# Altium schematic sheet Block_UART, I2C, CAN and GPIOs.SchDoc
size A3; SheetNumber: 2; SheetTotal: 16
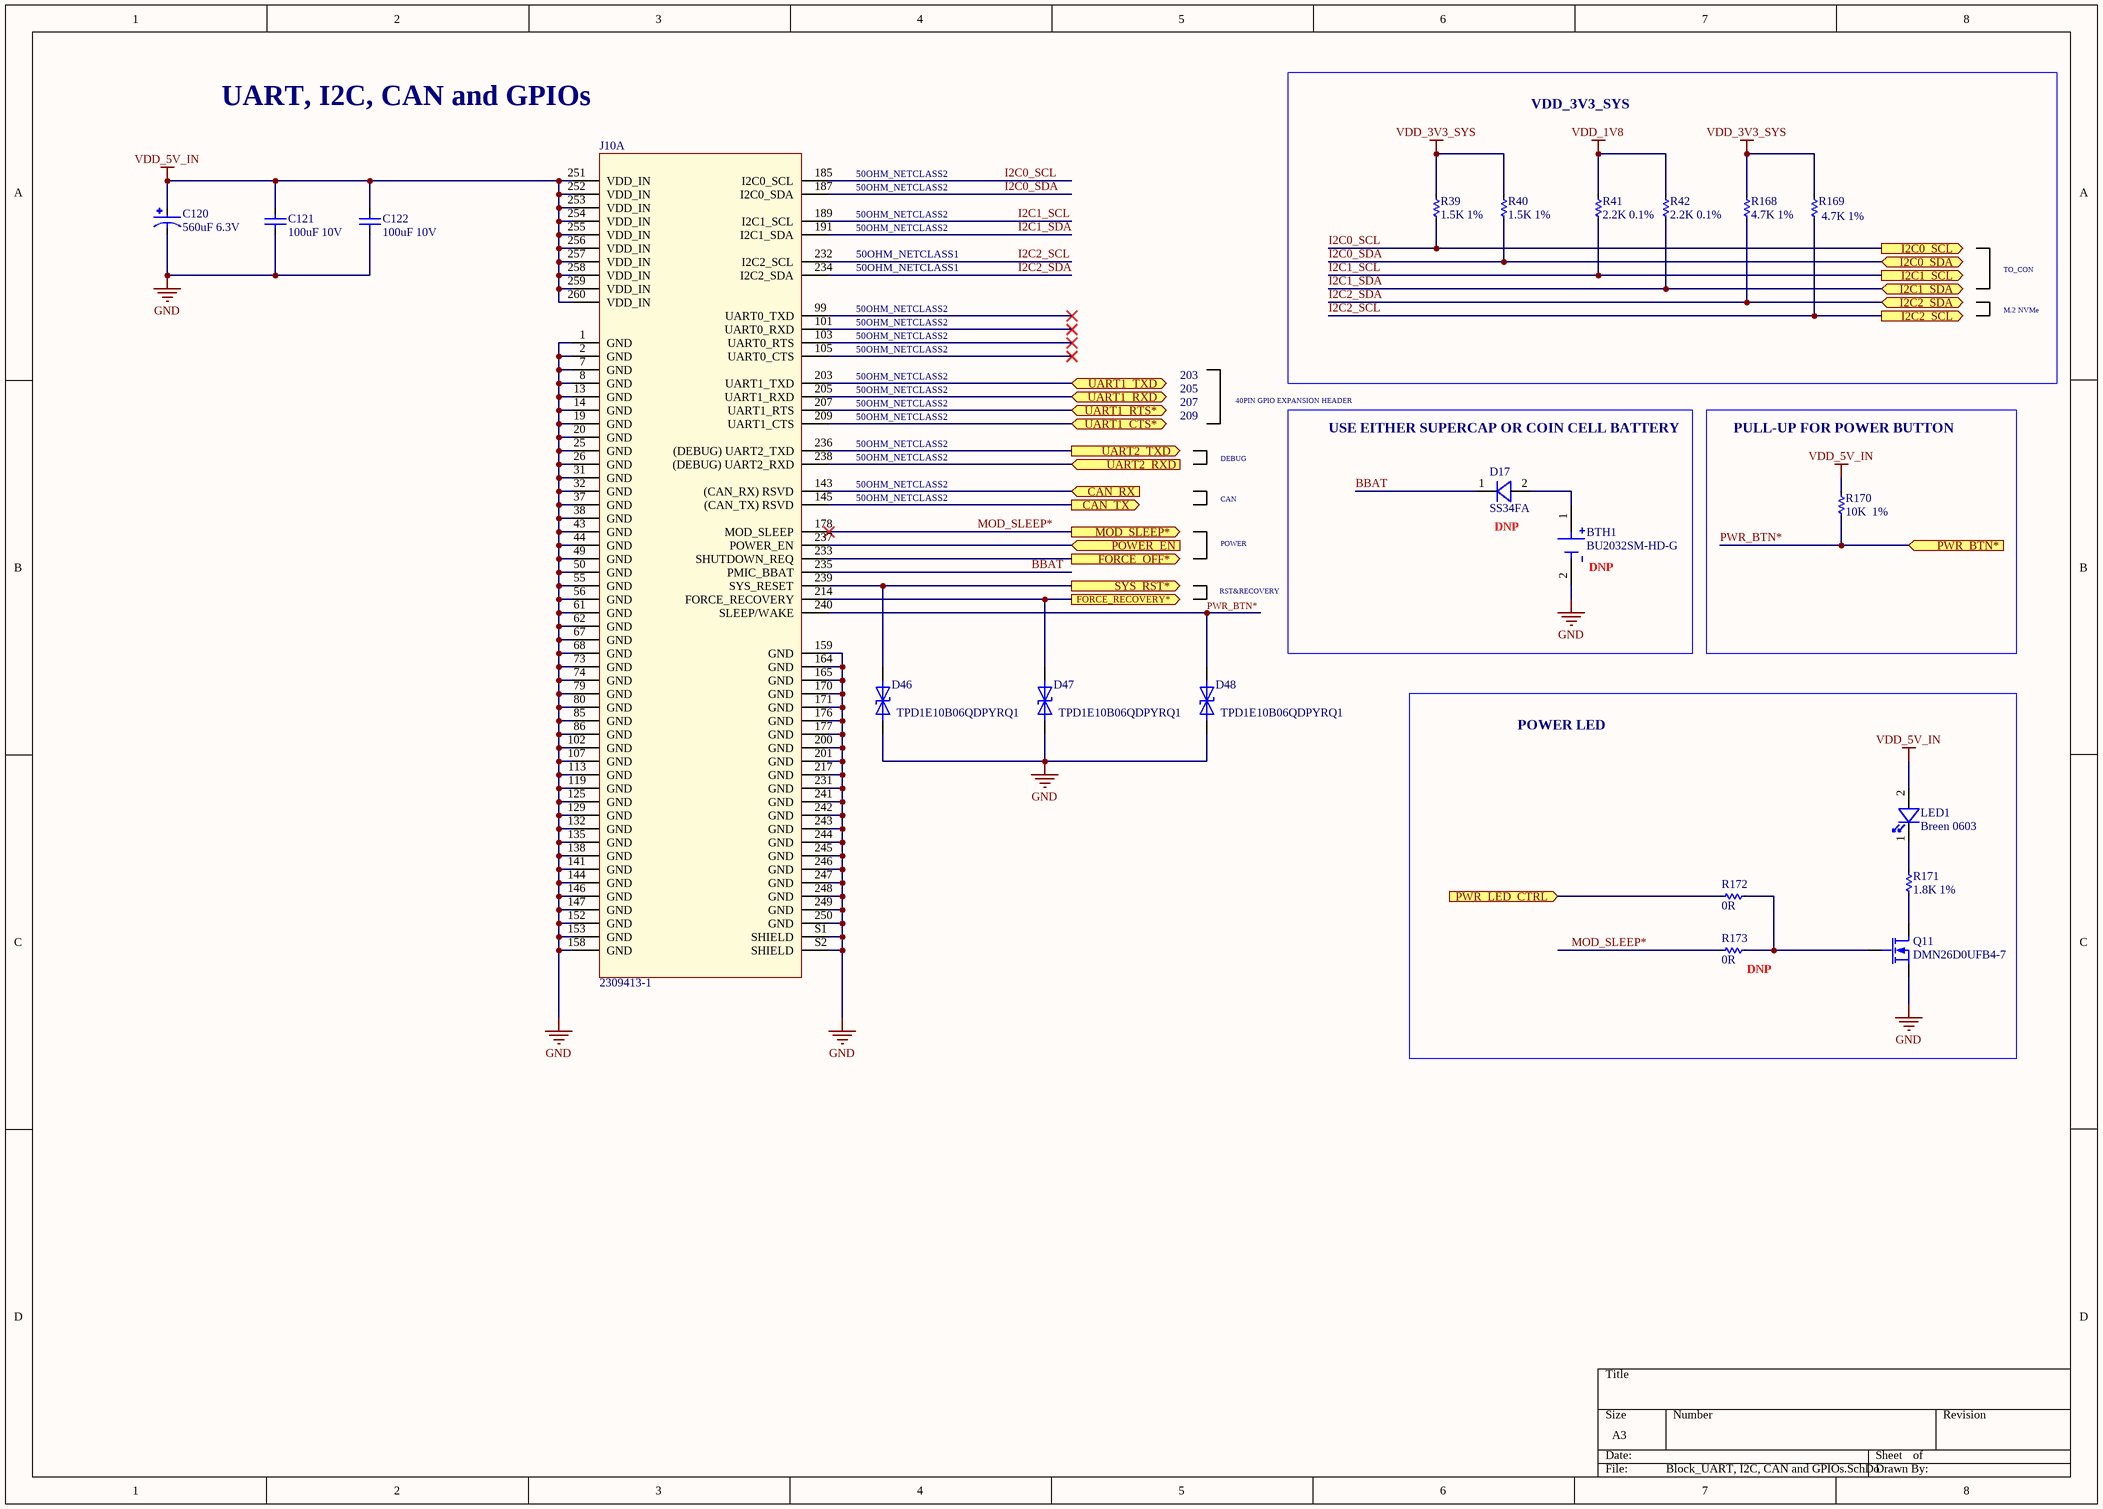
[diagram p0: Block_UART, I2C, CAN and GPIOs.SchDoc]

## Parts
BTH1  BU2032SM-HD-G  [BU2032SM-HD-G]
C120  560uF 6.3V  [CP_ELEC_8X7.7]
C121  100uF 10V  [C1210]
C122  100uF 10V  [C1210]
D17  SS34FA  [SOD123F]
D46  TPD1E10B06QDPYRQ1  [2-X1SON (1x.60)]
D47  TPD1E10B06QDPYRQ1  [2-X1SON (1x.60)]
D48  TPD1E10B06QDPYRQ1  [2-X1SON (1x.60)]
J10  2309413-1  [2309413-1]  (part A of 3)
LED1  Breen 0603  [LED_0603]
Q11  DMN26D0UFB4-7  [DFN1006-3]
R39  1.5K 1%  [R0402]
R40  1.5K 1%  [R0402]
R41  2.2K 0.1%  [R0603]
R42  2.2K 0.1%  [R0603]
R168  4.7K 1%  [R0402]
R169  4.7K 1%  [R0402]
R170  10K  1%  [R0402]
R171  1.8K 1%  [R0402]
R172  0R  [R0603]
R173  0R  [R0603]

## Blocks framed on the sheet
VDD_3V3_SYS: R39-R42 R168 R169
USE EITHER SUPERCAP OR COIN CELL BATTERY: BTH1 D17
PULL-UP FOR POWER BUTTON: R170
POWER LED: LED1 Q11 R171-R173

## Ports
CAN_RX (in), CAN_TX (out), FORCE_OFF* (out), FORCE_RECOVERY* (out), I2C0_SCL (out), I2C0_SDA (bidir), I2C1_SCL (out), I2C1_SDA (bidir), I2C2_SCL (out), I2C2_SDA (bidir), MOD_SLEEP* (out), POWER_EN (in), PWR_BTN* (in), PWR_LED_CTRL (in), SYS_RST* (out), UART1_CTS* (bidir), UART1_RTS* (bidir), UART1_RXD (bidir), UART1_TXD (bidir), UART2_RXD (in), UART2_TXD (out)

## Nets
GND: BTH1.2(NEG) C120.2(C) C121.1 C122.1 D46.1 D47.1 D48.1 J10.1(GND) J10.2(GND) J10.7(GND) J10.8(GND) J10.13(GND) J10.14(GND) J10.19(GND) J10.20(GND) J10.25(GND) J10.26(GND) J10.31(GND) J10.32(GND) J10.37(GND) J10.38(GND) J10.43(GND) J10.44(GND) J10.49(GND) J10.50(GND) J10.55(GND) J10.56(GND) J10.61(GND) J10.62(GND) J10.67(GND) J10.68(GND) J10.73(GND) J10.74(GND) J10.79(GND) J10.80(GND) J10.85(GND) J10.86(GND) J10.102(GND) J10.107(GND) J10.113(GND) J10.119(GND) J10.125(GND) J10.129(GND) J10.132(GND) J10.135(GND) J10.138(GND) J10.141(GND) J10.144(GND) J10.146(GND) J10.147(GND) J10.152(GND) J10.153(GND) J10.158(GND) J10.159(GND) J10.164(GND) J10.165(GND) J10.170(GND) J10.171(GND) J10.176(GND) J10.177(GND) J10.200(GND) J10.201(GND) J10.217(GND) J10.231(GND) J10.241(GND) J10.242(GND) J10.243(GND) J10.244(GND) J10.245(GND) J10.246(GND) J10.247(GND) J10.248(GND) J10.249(GND) J10.250(GND) J10.S1(SHIELD) J10.S2(SHIELD) Q11.2(S)
VDD_1V8: R41.2 R42.2
VDD_3V3_SYS: R39.2 R40.2 R168.2 R169.2
VDD_5V_IN: C120.1(A) C121.2 C122.2 J10.251(VDD_IN) J10.252(VDD_IN) J10.253(VDD_IN) J10.254(VDD_IN) J10.255(VDD_IN) J10.256(VDD_IN) J10.257(VDD_IN) J10.258(VDD_IN) J10.259(VDD_IN) J10.260(VDD_IN) LED1.2(A) R170.2
BBAT: D17.1(K) J10.235(PMIC_BBAT)
CAN_RX: J10.143((CAN_RX)_RSVD) ; port CAN_RX
CAN_TX: J10.145((CAN_TX)_RSVD) ; port CAN_TX
FORCE_OFF*: J10.233(SHUTDOWN_REQ) ; port FORCE_OFF*
FORCE_RECOVERY*: D47.2 J10.214(FORCE_RECOVERY) ; port FORCE_RECOVERY*
I2C0_SCL: J10.185(I2C0_SCL) R39.1 ; port I2C0_SCL
I2C0_SDA: J10.187(I2C0_SDA) R40.1 ; port I2C0_SDA
I2C1_SCL: J10.189(I2C1_SCL) R41.1 ; port I2C1_SCL
I2C1_SDA: J10.191(I2C1_SDA) R42.1 ; port I2C1_SDA
I2C2_SCL: J10.232(I2C2_SCL) R169.1 ; port I2C2_SCL
I2C2_SDA: J10.234(I2C2_SDA) R168.1 ; port I2C2_SDA
MOD_SLEEP*: J10.178(MOD_SLEEP) R173.1 ; port MOD_SLEEP*
POWER_EN: J10.237(POWER_EN) ; port POWER_EN
PWR_BTN*: D48.2 J10.240(SLEEP/WAKE) R170.1 ; port PWR_BTN*
PWR_LED_CTRL: R172.1 ; port PWR_LED_CTRL
SYS_RST*: D46.2 J10.239(SYS_RESET) ; port SYS_RST*
UART1_CTS*: J10.209(UART1_CTS) ; port UART1_CTS*
UART1_RTS*: J10.207(UART1_RTS) ; port UART1_RTS*
UART1_RXD: J10.205(UART1_RXD) ; port UART1_RXD
UART1_TXD: J10.203(UART1_TXD) ; port UART1_TXD
UART2_RXD: J10.238((DEBUG)_UART2_RXD) ; port UART2_RXD
UART2_TXD: J10.236((DEBUG)_UART2_TXD) ; port UART2_TXD
NetBTH1_1: BTH1.1(POS) D17.2(A)
NetLED1_1: LED1.1(K) R171.2
NetQ11_1: Q11.1(G) R172.2 R173.2
NetQ11_3: Q11.3(D) R171.1

Not connected (* = marked no-connect by the designer): J10 99(UART0_TXD)* 101(UART0_RXD)* 103(UART0_RTS)* 105(UART0_CTS)*

## Notes on the sheet
- UART, I2C, CAN and GPIOs
- 50OHM_NETCLASS2
- 50OHM_NETCLASS1
- M.2 NVMe
- TO_CON
- 203
- 205
- 207
- 209
- 40PIN GPIO EXPANSION HEADER
- DEBUG
- CAN
- POWER
- (near D17) DNP
- (near BTH1) DNP
- RST&RECOVERY
- (near R173) DNP

## Library data of the parts
BTH1 = BU2032SM-HD-G: CR2032 socket on T & R (40; Manufacturer: Memory Protection Devices; Number of Cells: 1; Supplier 1: Digi-Key; Manufacturer Part Number: BU2032SM-HD-G; RoHS: Yes; Category: Connectors; Stock 1: 98391; Pricing 1: 1=1.29000, 10=1.09000, 50=0.95860, 100=0.90350 (USD); Mount: Surface Mount,PCB; Case/Package: SMD/SMT; Min Operating Temperature: -40°C; Max Operating Temperature: 280°C; Package Quantity: 1; Termination: SMD/SMT; Packaging: Cut Tape; Diameter: 20mm; Lead Free: Lead Free; ComponentLink1URL: https://datasheet.ciiva.com/3/bu2032sm-hd-g-datasheet-3825.pdf?src-supplier=Digi-Key; ComponentLink1Description: https://datasheet.ciiva.com/3/bu2032sm-hd-g-datasheet-3825.pdf?src-supplier=Digi-Key; ComponentLink2URL: https://datasheet.ciiva.com/3/bu2032sm-hd-g-datasheet-3826.pdf?src-supplier=Digi-Key; ComponentLink2Description: https://datasheet.ciiva.com/3/bu2032sm-hd-g-datasheet-3826.pdf?src-supplier=Digi-Key; ComponentLink3URL: https://datasheet.ciiva.com/3/bu2032sm-hd-g-datasheet-3827.pdf?src-supplier=Digi-Key; ComponentLink3Description: https://datasheet.ciiva.com/3/bu2032sm-hd-g-datasheet-3827.pdf?src-supplier=Digi-Key; Supplier Part Number 1: BU2032SM-HD-GCT-ND
C120 = RHA0J561MCN1GS: Cap Aluminum Polymer 560uF 6.3VDC 20% (8 X 7.7mm) SMD 0.009 Ohm 4500mA 2000h 105C T/R; Manufacturer: Nichicon; ESR (Equivalent Series Resistance): 9mR; Life (Hours): 2000Hour; Ripple Current: 4.5A; Leakage Current: 1.0584mA; Dissipation Factor: 0.12%; Supplier 1: Digi-Key; Manufacturer Part Number: RHA0J561MCN1GS; RoHS: Yes; Category: Polymer Capacitors; Stock 1: 37081; Pricing 1: 1=1.16000, 10=0.88500, 50=0.73500, 100=0.63290 (USD); Mount: Surface Mount; Case/Package: Radial; Min Operating Temperature: -55°C; Max Operating Temperature: 105°C; Capacitance: 560uF; Tolerance: 20%; Voltage Rating: 6.3V; Packaging: Tape and Reel; Package Quantity: 1; Voltage Rating (DC): 6.3V; Termination: SMD/SMT; Series: FPCAP, HA; Construction: Cylindrical; Diameter: 8mm; Length: 7.7mm; Width: 8.3mm; Height: 8.3mm; Height - Seated (Max): 0.303inch; Radiation Hardening: No; RoHS Compliant: Yes; ComponentLink1URL: https://datasheet.ciiva.com/16481/2009fpcap-catalog-hsha-16481370.pdf?src-supplier=Future+Electronics; ComponentLink1Description: https://datasheet.ciiva.com/16481/2009fpcap-catalog-hsha-16481370.pdf?src-supplier=Future+Electronics; ComponentLink2URL: https://datasheet.ciiva.com/101/e-hs-ha-101946.pdf?src-supplier=Digi-Key; ComponentLink2Description: https://datasheet.ciiva.com/101/e-hs-ha-101946.pdf?src-supplier=Digi-Key; ComponentLink3URL: https://datasheet.ciiva.com/101/e-hs-ha-101947.pdf?src-supplier=Digi-Key; ComponentLink3Description: https://datasheet.ciiva.com/101/e-hs-ha-101947.pdf?src-supplier=Digi-Key; ComponentLink4URL: https://datasheet.ciiva.com/101/e-hs-ha-101948.pdf?src-supplier=Digi-Key; ComponentLink4Description: https://datasheet.ciiva.com/101/e-hs-ha-101948.pdf?src-supplier=Digi-Key; Supplier Part Number 1: 493-3772-1-ND
C121 C122 = LMK325ABJ107MM-P: Multilayer Ceramic Capacitors (High dielectric type), 10V, 100 uF, ± 20 %, 1210, X5R, RoHS; Manufacturer: Taiyo Yuden; Tolerance: 20%; Supplier 1: Digi-Key; Manufacturer Part Number: LMK325ABJ107MM-P; RoHS: Yes; Category: Ceramic Capacitors; Stock 1: 461999; Pricing 1: 1=1.12000, 10=0.88100, 50=0.76360, 100=0.66080, 500=0.49930 (USD); Mount: Surface Mount; Case/Package: 1210; Case Code (Metric): 3225; Case Code (Imperial): 1210; Contact Plating: Tin; Min Operating Temperature: -55°C; Max Operating Temperature: 85°C; Capacitance: 100uF; Packaging: Tape and Reel; Voltage Rating: 10V; Dielectric: X5R; Termination: Wraparound; Length: 0.126inch; Width: 0.098inch; Thickness: 0.11inch; Lead Free: Lead Free; RoHS Compliant: Yes; ComponentLink1URL: http://ds.yuden.co.jp/TYCOMPAS/or/detail.do?productNo=LMK325ABJ107MM-P&dataUnit=M&src-supplier=Avnet; ComponentLink1Description: http://ds.yuden.co.jp/TYCOMPAS/or/detail.do?productNo=LMK325ABJ107MM-P&dataUnit=M&src-supplier=Avnet; ComponentLink2URL: http://ds.yuden.co.jp/TYCOMPAS/ut/detail.do?productNo=LMK325ABJ107MM-P&fileName=LMK325ABJ107MM-P_SS&mode=specSheetDownload&src-supplier=Digi-Key; ComponentLink2Description: http://ds.yuden.co.jp/TYCOMPAS/ut/detail.do?productNo=LMK325ABJ107MM-P&fileName=LMK325ABJ107MM-P_SS&mode=specSheetDownload&src-supplier=Digi-Key; ComponentLink3URL: https://www.yuden.co.jp/productdata/catalog/mlcc01_e.pdf?src-supplier=Digi-Key; ComponentLink3Description: https://www.yuden.co.jp/productdata/catalog/mlcc01_e.pdf?src-supplier=Digi-Key; Supplier Part Number 1: 587-4317-1-ND
D17 = SS34FA: SS34FA Series 40 V 3 A Surface Mount Schottky Barrier Rectifier - SOD-123FA; Manufacturer: ON Semiconductor / Fairchild; Average Rectified Current: 3A; Element Configuration: Single; Max Forward Surge Current (Ifsm): 80A; Max Repetitive Reverse Voltage (Vrrm): 40V; Supplier 1: Mouser; Manufacturer Part Number: SS34FA; RoHS: Yes; Category: Schottky Diodes; Stock 1: 147819; Pricing 1: 1=0.53000, 10=0.42000, 50=0.42000, 100=0.31500, 1000=0.20500, 10000=0.16500 (USD); Mount: Surface Mount; Case/Package: SOD; Weight: 0.019g; Packaging: Tape and Reel; Max Reverse Voltage (DC): 40V; RoHS Compliant: Yes; ComponentLink1URL: http://www.mouser.com/ds/2/149/SS34FA-1012641.pdf?src-supplier=Mouser; ComponentLink1Description: http://www.mouser.com/ds/2/149/SS34FA-1012641.pdf?src-supplier=Mouser; ComponentLink2URL: http://www.farnell.com/datasheets/2552647.pdf?src-supplier=Farnell; ComponentLink2Description: http://www.farnell.com/datasheets/2552647.pdf?src-supplier=Farnell; ComponentLink3URL: http://www.farnell.com/datasheets/2552647.pdf?src-supplier=Newark; ComponentLink3Description: http://www.farnell.com/datasheets/2552647.pdf?src-supplier=Newark; ComponentLink4URL: https://www.fairchildsemi.com/datasheets/SS/SS34FA.pdf?src-supplier=Digi-Key; ComponentLink4Description: https://www.fairchildsemi.com/datasheets/SS/SS34FA.pdf?src-supplier=Digi-Key; Supplier Part Number 1: 512-SS34FA
D46-D48 = TPD1E10B06QDPYRQ1: Automotive 12-pF, ±5.5V ±30-kV ESD protection diode in 0402 Package 2-X1SON -40 to 125; Manufacturer: Texas Instruments; Capacitance: 12pF; Number of Channels: 1; Supplier 1: Mouser; Manufacturer Part Number: TPD1E10B06QDPYRQ1; RoHS: Yes; Category: TVS Diodes; Stock 1: 130973; Pricing 1: 1=0.46000, 10=0.34900, 50=0.34900, 100=0.21800, 1000=0.11500, 10000=0.08800 (USD); Case/Package: 0402; Number of Pins: 2; Min Operating Temperature: -40°C; Max Operating Temperature: 125°C; Lead Free: Lead Free; RoHS Compliant: Yes; ComponentLink1URL: http://www.ti.com/lit/ds/symlink/tpd1e10b06-q1.pdf?src-supplier=Digi-Key; ComponentLink1Description: http://www.ti.com/lit/ds/symlink/tpd1e10b06-q1.pdf?src-supplier=Digi-Key; ComponentLink2URL: http://www.ti.com/general/docs/suppproductinfo.tsp?distId=10&amp;gotoUrl=http%3A%2F%2Fwww.ti.com%2Flit%2Fgpn%2Ftpd1e10b06-q1&src-supplier=Digi-Key; ComponentLink2Description: http://www.ti.com/general/docs/suppproductinfo.tsp?distId=10&amp;gotoUrl=http%3A%2F%2Fwww.ti.com%2Flit%2Fgpn%2Ftpd1e10b06-q1&src-supplier=Digi-Key; Supplier Part Number 1: 595-PD1E10B06QDPYRQ1
J10 = 2309413-1: Conn DDR4 DIMM Socket SKT 260 POS 0.5mm Solder RA SMD T/R; Manufacturer: TE Connectivity; Supplier 1: Mouser; Manufacturer Part Number: 2309413-1; RoHS: Yes; Category: Memory Connectors; Stock 1: 11271; Pricing 1: 1=1.81000, 10=1.54000, 50=1.54000, 100=1.47000, 1000=1.16000, 10000=1.15000 (USD); ComponentLink1URL: https://www.te.com/commerce/DocumentDelivery/DDEController?Action=srchrtrv&DocNm=2309413&DocType=Customer+Drawing&DocLang=English&src-supplier=Digi-Key; ComponentLink1Description: https://www.te.com/commerce/DocumentDelivery/DDEController?Action=srchrtrv&DocNm=2309413&DocType=Customer+Drawing&DocLang=English&src-supplier=Digi-Key; ComponentLink2URL: https://www.te.com/commerce/DocumentDelivery/DDEController?Action=srchrtrv&amp;DocNm=2309413&amp;DocType=Customer+Drawing&amp;DocLang=English&src-supplier=Digi-Key; ComponentLink2Description: https://www.te.com/commerce/DocumentDelivery/DDEController?Action=srchrtrv&amp;DocNm=2309413&amp;DocType=Customer+Drawing&amp;DocLang=English&src-supplier=Digi-Key; Supplier Part Number 1: 571-2309413-1
LED1 = LTST-C190GKT: LED Uni-Color Green 565nm 2-Pin Chip LED T/R; Manufacturer: Vishay Lite-On; Lens Color: Colorless; Luminous Intensity: 6mcd; Forward Voltage: 2.1V; Viewing Angle: 130°; Lens Style: Clear,Diffused,Colorless,Rectangular; Forward Current: 30mA; Dominant Wavelength: 569nm; Test Current: 10mA; Number of Elements: 1; Power Dissipation: 100mW; Reverse Voltage: 5V; Lens Transparency: Clear; Voltage: 2V; Manufacturer Part Number: LTST-C190GKT; RoHS: Yes; Category: LEDs; Stock 1: 696078; Pricing 1: 1=0.24000, 10=0.13200, 100=0.06110, 500=0.05640, 1000=0.04418, 2000=0.04324 (USD); Mount: Surface Mount; Case/Package: 0603; Number of Pins: 2; Color: Green; Case Code (Metric): 1608; Case Code (Imperial): 0603; Min Operating Temperature: -55°C; Max Operating Temperature: 85°C; Package Quantity: 1; Packaging: Tape and Reel; Wavelength: 565nm; Illumination Color: Green; Number of LEDs: 1; Power Rating: 100mW; Length: 1.6mm; Width: 0.8mm; Height: 0.8mm; Depth: 0.8mm; Radiation Hardening: No; RoHS Compliant: Yes; Lead Free: Lead Free; ComponentLink1URL: https://datasheet.ciiva.com/2109/ltst-c190gkt-2109985.pdf?src-supplier=Digi-Key; ComponentLink1Description: https://datasheet.ciiva.com/2109/ltst-c190gkt-2109985.pdf?src-supplier=Digi-Key; ComponentLink2URL: https://datasheet.ciiva.com/11775/0900766b80dc02a6-11775616.pdf?src-supplier=RSComponents; ComponentLink2Description: https://datasheet.ciiva.com/11775/0900766b80dc02a6-11775616.pdf?src-supplier=RSComponents; ComponentLink3URL: https://datasheet.ciiva.com/12403/lite-on-ltst-c190gkt-187204-12403884.pdf?src-supplier=Mouser; ComponentLink3Description: https://datasheet.ciiva.com/12403/lite-on-ltst-c190gkt-187204-12403884.pdf?src-supplier=Mouser; ComponentLink4URL: https://datasheet.ciiva.com/16392/lite-on20ltst-c190gkt-16392818.pdf?src-supplier=Future+Electronics; ComponentLink4Description: https://datasheet.ciiva.com/16392/lite-on20ltst-c190gkt-16392818.pdf?src-supplier=Future+Electronics; ComponentLink5URL: https://datasheet.ciiva.com/2109/ltst-c190gkt-2109986.pdf?src-supplier=Digi-Key; ComponentLink5Description: https://datasheet.ciiva.com/2109/ltst-c190gkt-2109986.pdf?src-supplier=Digi-Key; ComponentLink6URL: https://datasheet.ciiva.com/2109/ltst-c190gkt-2109987.pdf?src-supplier=Digi-Key; ComponentLink6Description: https://datasheet.ciiva.com/2109/ltst-c190gkt-2109987.pdf?src-supplier=Digi-Key; Supplier 1: Digi-Key; Supplier Part Number 1: 160-1183-1-ND
Q11 = DMN26D0UFB4-7: Single N-Channel 20 V 350 mW Silicon Surface Mount Mosfet - DFN-3; Manufacturer: Diodes; Rise Time: 7.9ns; Rds On Max: 3R; Input Capacitance: 14.1pF; Continuous Drain Current (ID): 240mA; Drain to Source Resistance: 1.8R; Power Dissipation: 350mW; Turn-Off Delay Time: 13.4ns; Drain to Source Voltage (Vdss): 20V; Turn-On Delay Time: 3.8ns; Fall Time: 15.2ns; Number of Elements: 1; Gate to Source Voltage (Vgs): 10V; On-State Resistance: 10R; FET Type: 1 N-Channel; Supplier 1: Mouser; Manufacturer Part Number: DMN26D0UFB4-7; RoHS: Yes; Category: MOSFETs; Stock 1: 21043; Pricing 1: 1=0.38000, 10=0.32100, 50=0.32100, 100=0.17000, 1000=0.07700, 10000=0.05000 (USD); Mount: Surface Mount; Case/Package: DFN; Number of Pins: 3; Min Operating Temperature: -55°C; Max Operating Temperature: 150°C; Packaging: Tape and Reel; Package Quantity: 3000; Max Power Dissipation: 350mW; Element Configuration: Single; Number of Channels: 1; Polarity: N-CHANNEL; Series: -; Drain-source On Resistance-Max: 10R; Length: 1.05mm; Width: 0.65mm; Height: 0.35mm; Radiation Hardening: No; Reach SVHC Compliant: Yes; Lead Free: Lead Free; RoHS Compliant: Yes; ComponentLink1URL: https://datasheet.ciiva.com/4443/ds31775-89139-4443083.pdf?src-supplier=Mouser; ComponentLink1Description: https://datasheet.ciiva.com/4443/ds31775-89139-4443083.pdf?src-supplier=Mouser; ComponentLink2URL: https://datasheet.ciiva.com/11176/ds31775-11176556.pdf?src-supplier=Avnet; ComponentLink2Description: https://datasheet.ciiva.com/11176/ds31775-11176556.pdf?src-supplier=Avnet; ComponentLink3URL: https://datasheet.ciiva.com/16434/ds31775-16434037.pdf?src-supplier=Future+Electronics; ComponentLink3Description: https://datasheet.ciiva.com/16434/ds31775-16434037.pdf?src-supplier=Future+Electronics; ComponentLink4URL: https://datasheet.ciiva.com/48532/ds31775-48532486.pdf?src-supplier=Avnet; ComponentLink4Description: https://datasheet.ciiva.com/48532/ds31775-48532486.pdf?src-supplier=Avnet; ComponentLink5URL: https://datasheet.ciiva.com/934/ds31775-934573.pdf?src-supplier=Digi-Key; ComponentLink5Description: https://datasheet.ciiva.com/934/ds31775-934573.pdf?src-supplier=Digi-Key; ComponentLink6URL: https://datasheet.ciiva.com/934/ds31775-934574.pdf?src-supplier=Digi-Key; ComponentLink6Description: https://datasheet.ciiva.com/934/ds31775-934574.pdf?src-supplier=Digi-Key; ComponentLink7URL: https://datasheet.ciiva.com/934/ds31775-934572.pdf?src-supplier=Digi-Key; ComponentLink7Description: https://datasheet.ciiva.com/934/ds31775-934572.pdf?src-supplier=Digi-Key; Supplier Part Number 1: 621-DMN26D0UFB4-7
R39 R40 = RC0402FR-071K5L: RES SMD 1.5K OHM 1% 1/16W 0402; Manufacturer: Yageo; Resistance: 1.5kR; Power Rating: 62.5mW; Voltage Rating: 50V; Temperature Coefficient: 100ppm/°C; Max Power Dissipation: 63mW; Supplier 1: Digi-Key; Manufacturer Part Number: RC0402FR-071K5L; RoHS: Yes; Category: Chip SMD Resistors; Stock 1: 3362948; Pricing 1: 1=0.10000, 10=0.01400, 100=0.00580, 1000=0.00262, 2500=0.00228, 5000=0.00188 (USD); Case/Package: 0402; Case Code (Metric): 1005; Case Code (Imperial): 0402; Size Code: 0402; Min Operating Temperature: -55°C; Max Operating Temperature: 155°C; Package Quantity: 1; Tolerance: 1%; Packaging: Tape and Reel; Resistor Type: Thick Film; Number of Terminations: 2; Termination: SMD/SMT; Features: Moisture Resistant; Series: RC; Resistance Tolerance: 1%; Construction: Rectangular; Technology: THICK FILM; Length: 1mm; Width: 0.02inch; Height: 0.016inch; Depth: 0.5mm; Reach SVHC Compliant: Yes; Military Standard: Not; Lead Free: Lead Free; RoHS Compliant: Yes; ComponentLink1URL: https://datasheet.ciiva.com/11808/0900766b80c66297-11808238.pdf?src-supplier=RSComponents; ComponentLink1Description: https://datasheet.ciiva.com/11808/0900766b80c66297-11808238.pdf?src-supplier=RSComponents; ComponentLink2URL: https://datasheet.ciiva.com/46394/1018594-46394950.pdf?src-supplier=Element14; ComponentLink2Description: https://datasheet.ciiva.com/46394/1018594-46394950.pdf?src-supplier=Element14; ComponentLink3URL: https://datasheet.ciiva.com/2453/pyu-r-int-thick-7-2453440.pdf?src-supplier=Digi-Key; ComponentLink3Description: https://datasheet.ciiva.com/2453/pyu-r-int-thick-7-2453440.pdf?src-supplier=Digi-Key; ComponentLink4URL: https://datasheet.ciiva.com/2453/pyu-r-int-thick-7-2453441.pdf?src-supplier=Digi-Key; ComponentLink4Description: https://datasheet.ciiva.com/2453/pyu-r-int-thick-7-2453441.pdf?src-supplier=Digi-Key; ComponentLink5URL: https://datasheet.ciiva.com/2453/pyu-r-int-thick-7-2453439.pdf?src-supplier=Digi-Key; ComponentLink5Description: https://datasheet.ciiva.com/2453/pyu-r-int-thick-7-2453439.pdf?src-supplier=Digi-Key; ComponentLink6URL: https://datasheet.ciiva.com/12558/pyu-rc0402-51-rohs-l-6-r-8721-12558542.pdf?src-supplier=Mouser; ComponentLink6Description: https://datasheet.ciiva.com/12558/pyu-rc0402-51-rohs-l-6-r-8721-12558542.pdf?src-supplier=Mouser; ComponentLink7URL: https://datasheet.ciiva.com/7849/1018594-7849863.pdf?src-supplier=Element14; ComponentLink7Description: https://datasheet.ciiva.com/7849/1018594-7849863.pdf?src-supplier=Element14; ComponentLink8URL: https://datasheet.ciiva.com/7849/1018594-7849864.pdf?src-supplier=Element14; ComponentLink8Description: https://datasheet.ciiva.com/7849/1018594-7849864.pdf?src-supplier=Element14; ComponentLink9URL: https://datasheet.ciiva.com/15189/getdatasheetpartid-323992-15189370.pdf?src-supplier=Verical; ComponentLink9Description: https://datasheet.ciiva.com/15189/getdatasheetpartid-323992-15189370.pdf?src-supplier=Verical; Supplier Part Number 1: 311-1.50KLRCT-ND
R41 R42 = CPF0603B2K2E1: Res Thin Film 0603 2.2K Ohm 0.1% 1/16W ±25ppm/°C Molded SMD SMD Paper T/R; Manufacturer: TE Connectivity Neohm; Resistance: 2.2kR; Power Rating: 63mW; Voltage Rating: 50V; Voltage Rating (DC): 120V; Number of Resistors: 1; Supplier 1: Digi-Key; Manufacturer Part Number: CPF0603B2K2E1; RoHS: Yes; Category: Chip SMD Resistors; Stock 1: 150750; Pricing 1: 1=0.69000, 10=0.49000, 100=0.25450, 500=0.17622 (USD); Mount: Surface Mount; Case/Package: 0603; Number of Pins: 2; Case Code (Imperial): 0603; Case Code (Metric): 1608; Weight: 7.1E-05oz; Min Operating Temperature: -55°C; Max Operating Temperature: 155°C; Tolerance: 0.1%; Packaging: Tape and Reel; Resistor Type: Thin Film; Package Quantity: 1000; Termination: Solder; Temperature Coefficient: 25ppm/°C; Number of Terminations: 2; Series: CPF; Resistance Tolerance: 0.1%; Length: 1.55mm; Width: 0.8mm; Height: 0.45mm; Radiation Hardening: No; Reach SVHC Compliant: Yes; ELV: Compliant; RoHS Compliant: Yes; ComponentLink1URL: https://datasheet.ciiva.com/7789/eng-ds-1773200-j-7789503.pdf?src-supplier=Element14; ComponentLink1Description: https://datasheet.ciiva.com/7789/eng-ds-1773200-j-7789503.pdf?src-supplier=Element14; Supplier Part Number 1: A103077DKR-ND
R168 R169 = RC0402FR-074K7L: YAGEO (PHYCOMP) - RC0402FR-074K7L - RES, THICK FILM, 4K7, 1%, 0.063W, 0402; Voltage Rating (DC): 50V; Power Rating: 62.5mW; Resistance: 4.7kR; Temperature Coefficient: 100ppm/°C; Max Power Dissipation: 63mW; Supplier 1: Digi-Key; Manufacturer: Yageo; Manufacturer Part Number: RC0402FR-074K7L; RoHS: Yes; Category: Chip SMD Resistors; Stock 1: 22298998; Pricing 1: 1=0.10000, 10=0.01400, 100=0.00580, 1000=0.00262, 2500=0.00228, 5000=0.00188 (USD); Case/Package: 0402; Number of Pins: 2; Case Code (Imperial): 0402; Case Code (Metric): 1005; Size Code: 0402; Min Operating Temperature: -55°C; Max Operating Temperature: 155°C; Tolerance: 1%; Voltage Rating: 50V; Packaging: Tape and Reel; Resistor Type: Thick Film; Termination: SMD/SMT; Features: Moisture Resistant; Series: RC; Number of Terminations: 2; Resistance Tolerance: 1%; Construction: Rectangular; Length: 1mm; Width: 0.5mm; Height: 0.32mm; Depth: 0.5mm; Height - Seated (Max): 0.016inch; Reach SVHC Compliant: Yes; Military Standard: Not; Lead Free: Lead Free; RoHS Compliant: Yes; ComponentLink1URL: https://datasheet.ciiva.com/22661/1686128-22661342.pdf?src-supplier=Element14; ComponentLink1Description: https://datasheet.ciiva.com/22661/1686128-22661342.pdf?src-supplier=Element14; ComponentLink2URL: https://datasheet.ciiva.com/7850/1018594-7850022.pdf?src-supplier=Element14; ComponentLink2Description: https://datasheet.ciiva.com/7850/1018594-7850022.pdf?src-supplier=Element14; ComponentLink3URL: https://datasheet.ciiva.com/7850/1018594-7850023.pdf?src-supplier=Element14; ComponentLink3Description: https://datasheet.ciiva.com/7850/1018594-7850023.pdf?src-supplier=Element14; ComponentLink4URL: https://datasheet.ciiva.com/15215/getdatasheetpartid-328119-15215035.pdf?src-supplier=Verical; ComponentLink4Description: https://datasheet.ciiva.com/15215/getdatasheetpartid-328119-15215035.pdf?src-supplier=Verical; Supplier Part Number 1: 311-4.7KLRCT-ND
R170 = RC0402FR-0710KP: Res General Purpose Thick Film 0402 10K Ohm 1% 1/16W ±100ppm/°C Molded SMD Paper T/R; Manufacturer: Yageo; Resistance: 10kR; Max Power Dissipation: 63mW; Temperature Coefficient: 150ppm/°C; Supplier 1: Digi-Key; Manufacturer Part Number: RC0402FR-0710KP; RoHS: Yes; Category: Chip SMD Resistors; Stock 1: 1032587; Pricing 1: 1=0.10000, 10=0.03100, 100=0.01280, 1000=0.00573, 2500=0.00497, 5000=0.00411 (USD); Case/Package: 0402; Case Code (Metric): 1005; Case Code (Imperial): 0402; Min Operating Temperature: -55°C; Max Operating Temperature: 155°C; Packaging: Tape and Reel; Resistor Type: Thick Film; Number of Terminations: 2; Tolerance: 1%; Features: Moisture Resistant; Length: 0.039inch; Width: 0.02inch; Height: 0.016inch; RoHS Compliant: Yes; ComponentLink1URL: http://www.yageo.com/NewPortal/yageodocoutput?fileName=/pdf/R-Chip/PYu-RC_51_RoHS_P_0.pdf&src-supplier=Digi-Key; ComponentLink1Description: http://www.yageo.com/NewPortal/yageodocoutput?fileName=/pdf/R-Chip/PYu-RC_51_RoHS_P_0.pdf&src-supplier=Digi-Key; Supplier Part Number 1: YAG1249CT-ND
R171 = RC0402FR-071K8L: Res General Purpose Thick Film 0402 1.8K Ohm 1% 1/16W ±100ppm/°C Molded SMD Paper T/R; Manufacturer: Yageo; Power Rating: 63mW; Resistance: 1.8kR; Voltage Rating: 50V; Supplier 1: Digi-Key; Manufacturer Part Number: RC0402FR-071K8L; RoHS: Yes; Category: Chip SMD Resistors; Stock 1: 1261689; Pricing 1: 1=0.10000, 10=0.01400, 100=0.00580, 1000=0.00262, 2500=0.00228, 5000=0.00188 (USD); Case/Package: 0402; Case Code (Imperial): 0402; Case Code (Metric): 1005; Min Operating Temperature: -55°C; Max Operating Temperature: 155°C; Tolerance: 1%; Packaging: Tape and Reel; Termination: SMD/SMT; Resistor Type: Thick Film; Number of Terminations: 2; Temperature Coefficient: 100ppm/°C; Max Power Dissipation: 63mW; Features: Moisture Resistant; Series: RC; Construction: Rectangular; Resistance Tolerance: 1%; Package Quantity: 1; Technology: THICK FILM; Working Voltage: 50V; Length: 0.039inch; Width: 0.02inch; Height: 0.016inch; Depth: 0.5mm; Military Standard: Not; Lead Free: Lead Free; RoHS Compliant: Yes; ComponentLink1URL: https://datasheet.ciiva.com/11819/0900766b80c66297-11819472.pdf?src-supplier=Rs; ComponentLink1Description: https://datasheet.ciiva.com/11819/0900766b80c66297-11819472.pdf?src-supplier=Rs; ComponentLink2URL: https://datasheet.ciiva.com/2453/pyu-r-int-thick-7-2453530.pdf?src-supplier=Digi-Key; ComponentLink2Description: https://datasheet.ciiva.com/2453/pyu-r-int-thick-7-2453530.pdf?src-supplier=Digi-Key; ComponentLink3URL: https://datasheet.ciiva.com/2453/pyu-r-int-thick-7-2453531.pdf?src-supplier=Digi-Key; ComponentLink3Description: https://datasheet.ciiva.com/2453/pyu-r-int-thick-7-2453531.pdf?src-supplier=Digi-Key; ComponentLink4URL: https://datasheet.ciiva.com/2453/pyu-r-int-thick-7-2453529.pdf?src-supplier=Digi-Key; ComponentLink4Description: https://datasheet.ciiva.com/2453/pyu-r-int-thick-7-2453529.pdf?src-supplier=Digi-Key; ComponentLink5URL: https://datasheet.ciiva.com/12667/pyu-rc0402-51-rohs-l-6-r-12667431.pdf?src-supplier=Mouser; ComponentLink5Description: https://datasheet.ciiva.com/12667/pyu-rc0402-51-rohs-l-6-r-12667431.pdf?src-supplier=Mouser; ComponentLink6URL: https://datasheet.ciiva.com/7849/1018594-7849868.pdf?src-supplier=Element14; ComponentLink6Description: https://datasheet.ciiva.com/7849/1018594-7849868.pdf?src-supplier=Element14; ComponentLink7URL: https://datasheet.ciiva.com/7849/1018594-7849867.pdf?src-supplier=Element14; ComponentLink7Description: https://datasheet.ciiva.com/7849/1018594-7849867.pdf?src-supplier=Element14; ComponentLink8URL: https://datasheet.ciiva.com/16744/pyu-rc0402-51-rohs-l-6-r-16744223.pdf?src-supplier=Future+Electronics; ComponentLink8Description: https://datasheet.ciiva.com/16744/pyu-rc0402-51-rohs-l-6-r-16744223.pdf?src-supplier=Future+Electronics; Supplier Part Number 1: 311-1.80KLRDKR-ND
R172 R173 = CR0603-J/-000ELF: RES SMD 0 OHM JUMPER 1/10W 0603; Manufacturer: Bourns; Resistance: 0mR; Power Rating: 100mW; Tolerance: 1%; Voltage Rating: 50V; Temperature Coefficient: 500ppm/°C; Resistance Tolerance: 5%; Supplier 1: Digi-Key; Manufacturer Part Number: CR0603-J/-000ELF; RoHS: Yes; Category: Chip SMD Resistors; Stock 1: 1690954; Pricing 1: 1=0.10000, 10=0.01300, 25=0.00960, 50=0.00720, 100=0.00540, 250=0.00408, 500=0.00328, 1000=0.00241 (USD); Mount: Surface Mount; Case/Package: 0603; Number of Pins: 2; Case Code (Imperial): 0603; Case Code (Metric): 1608; Contact Plating: Tin; Min Operating Temperature: -55°C; Max Operating Temperature: 155°C; Packaging: Tape and Reel; Package Quantity: 5000; Resistor Type: Thick Film; Termination: SMD/SMT; Max Power Dissipation: 100mW; Voltage Rating (DC): 50V; Series: CR0603; Technology: THICK FILM; Construction: Rectangular; Features: Moisture Resistant; Number of Terminations: 2; Length: 1.6mm; Width: 0.8mm; Height: 0.45mm; Depth: 0.8mm; Thickness: 457um; Radiation Hardening: No; Reach SVHC Compliant: Yes; Military Standard: Not; RoHS Compliant: Yes; ComponentLink1URL: https://datasheet.ciiva.com/11809/0900766b80fcdb72-11809586.pdf?src-supplier=RSComponents; ComponentLink1Description: https://datasheet.ciiva.com/11809/0900766b80fcdb72-11809586.pdf?src-supplier=RSComponents; ComponentLink2URL: https://datasheet.ciiva.com/7001/1902866-7001645.pdf?src-supplier=Newark; ComponentLink2Description: https://datasheet.ciiva.com/7001/1902866-7001645.pdf?src-supplier=Newark; ComponentLink3URL: https://datasheet.ciiva.com/7986/691949-7986171.pdf?src-supplier=Element14; ComponentLink3Description: https://datasheet.ciiva.com/7986/691949-7986171.pdf?src-supplier=Element14; ComponentLink4URL: https://datasheet.ciiva.com/7660/1856384-7660956.pdf?src-supplier=Element14; ComponentLink4Description: https://datasheet.ciiva.com/7660/1856384-7660956.pdf?src-supplier=Element14; ComponentLink5URL: https://datasheet.ciiva.com/22693/1902866-22693213.pdf?src-supplier=Element14; ComponentLink5Description: https://datasheet.ciiva.com/22693/1902866-22693213.pdf?src-supplier=Element14; ComponentLink6URL: https://datasheet.ciiva.com/5545/chpreztr-5545708.pdf?src-supplier=Mouser; ComponentLink6Description: https://datasheet.ciiva.com/5545/chpreztr-5545708.pdf?src-supplier=Mouser; ComponentLink7URL: https://datasheet.ciiva.com/16761/70154685-16761515.pdf?src-supplier=Allied+Electronics; ComponentLink7Description: https://datasheet.ciiva.com/16761/70154685-16761515.pdf?src-supplier=Allied+Electronics; ComponentLink8URL: https://datasheet.ciiva.com/30062/159chpreztr-30062601.pdf?src-supplier=Onlinecomponents.com; ComponentLink8Description: https://datasheet.ciiva.com/30062/159chpreztr-30062601.pdf?src-supplier=Onlinecomponents.com; ComponentLink9URL: https://datasheet.ciiva.com/48692/001055497-da-01-en-smd-wid-cr0603-j-000elf-0-0-ohm-1-10w-48692135.pdf?src-supplier=Conrad; ComponentLink9Description: https://datasheet.ciiva.com/48692/001055497-da-01-en-smd-wid-cr0603-j-000elf-0-0-ohm-1-10w-48692135.pdf?src-supplier=Conrad; Supplier Part Number 1: CR0603-J/-000ELFCT-ND